# Altium schematic sheet Sheet3_24-7.SchDoc
size A3; SheetNumber: 1; SheetTotal: 1
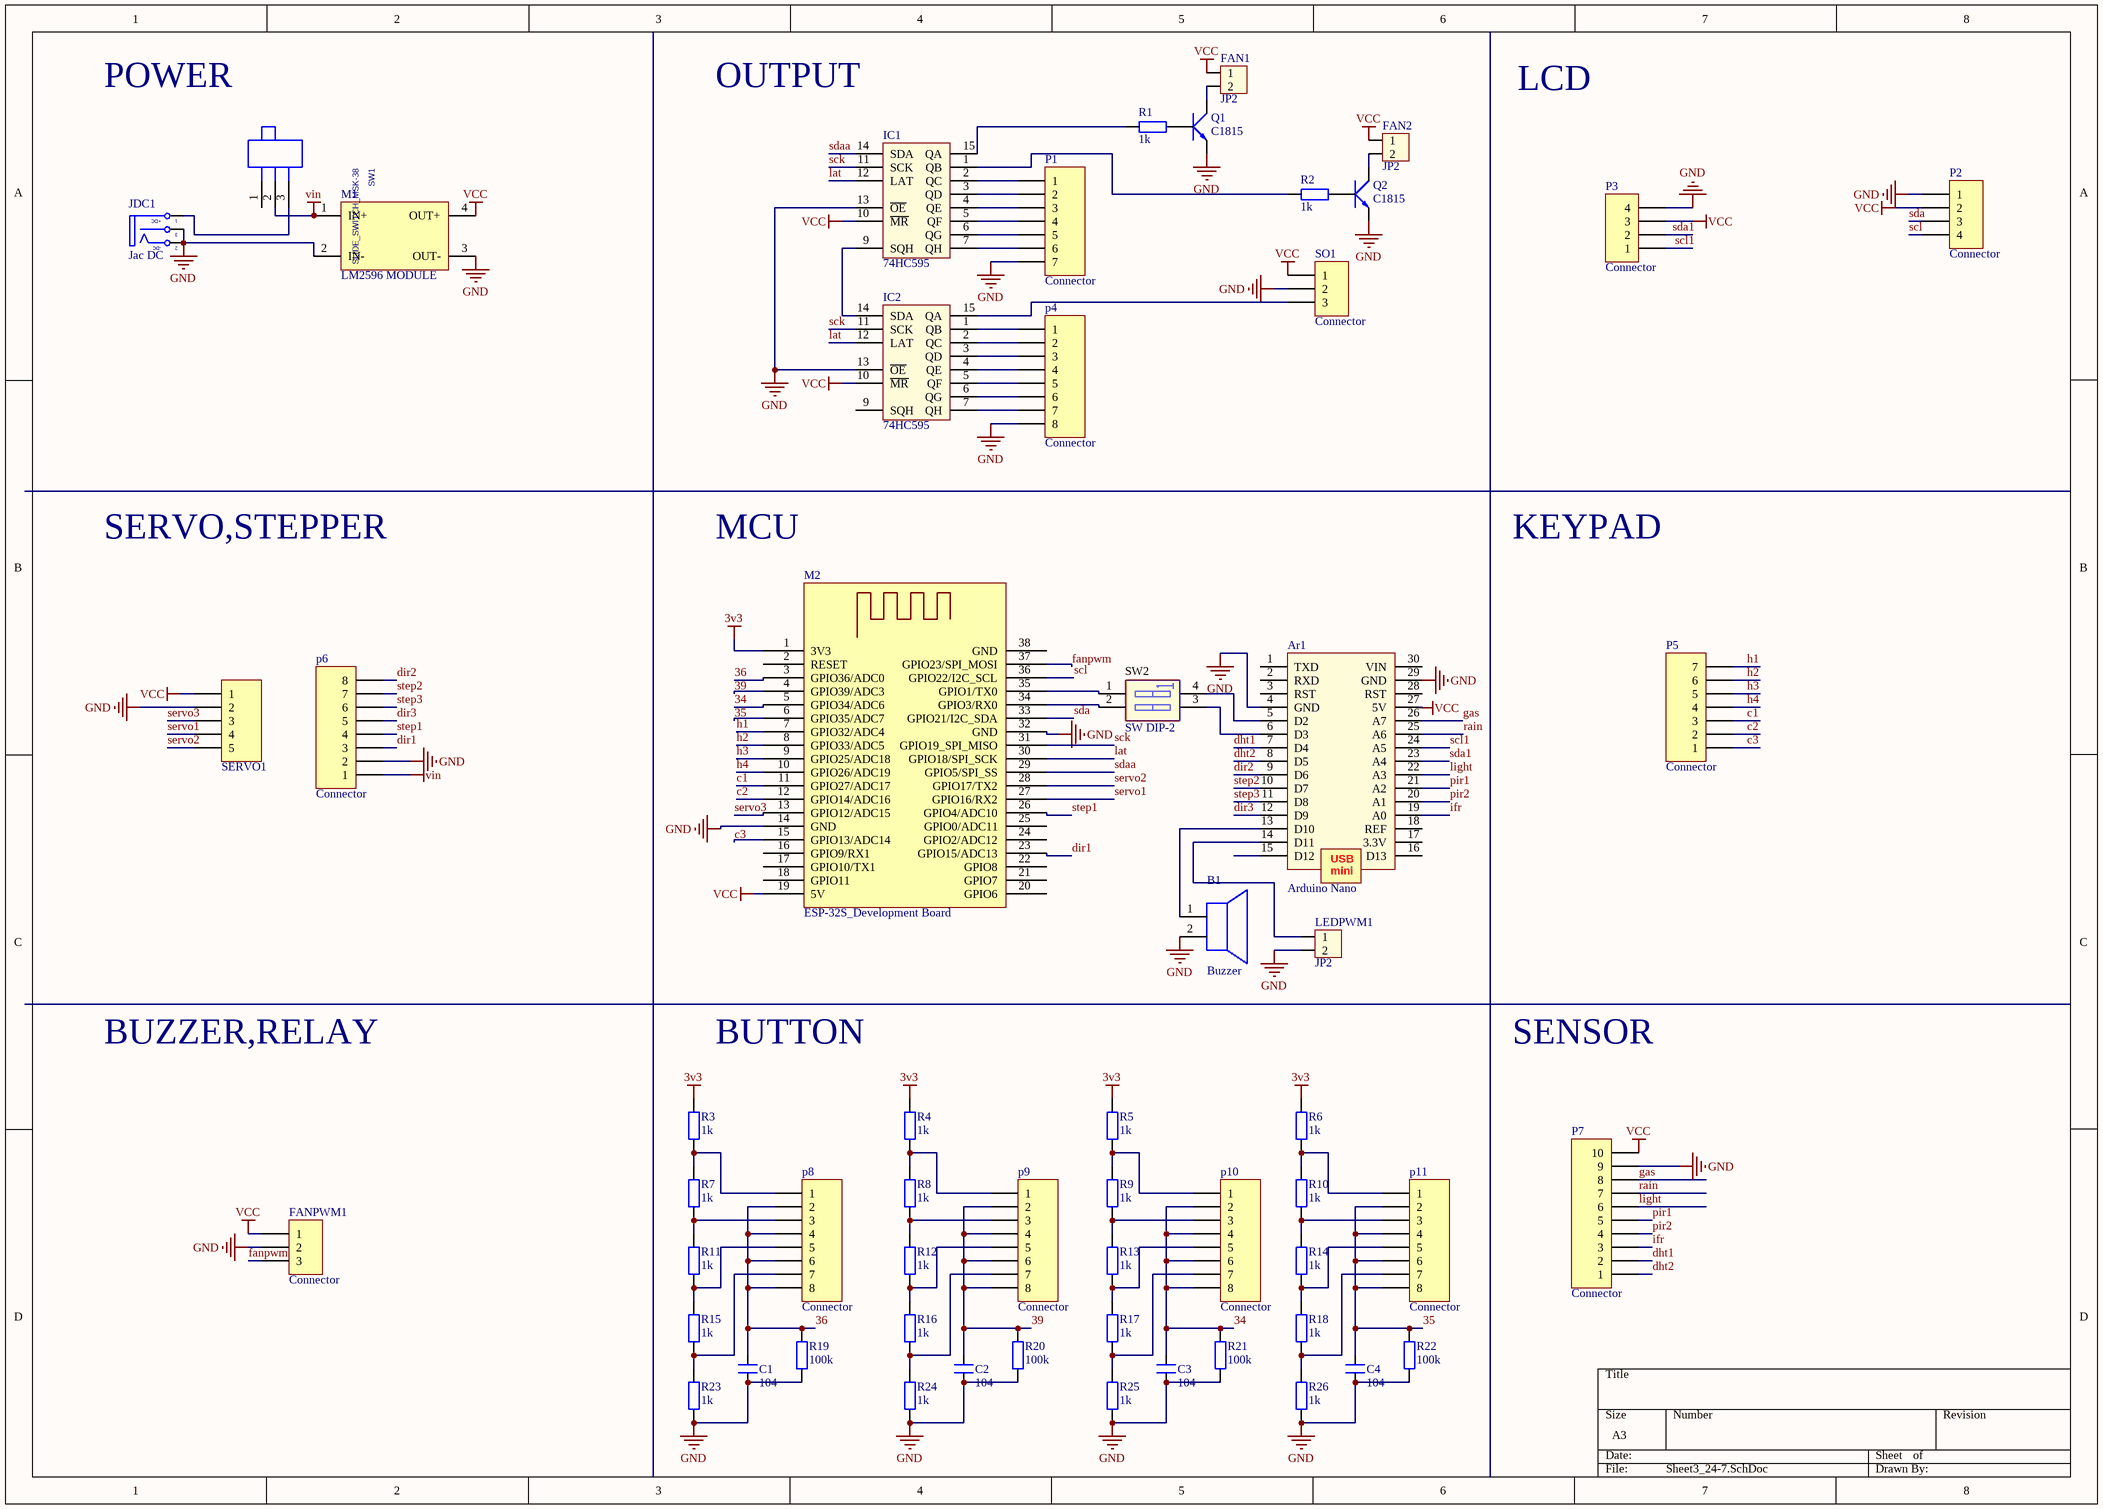
[diagram p0: Sheet3_24-7.SchDoc]

## Parts
Ar1  Arduino Nano  [Arduino_Nano]
B1  Buzzer  [Buzzer]
C1  104  [CN2]
C2  104  [CN2]
C3  104  [CN2]
C4  104  [CN2]
FAN1  JP2  [CON2]
FAN2  JP2  [CON2]
FANPWM1  Connector  [JST-XH_B3B-XH-A]
IC1  74HC595  [DIP16/W0.3]
IC2  74HC595  [DIP16/W0.3]
JDC1  Jac DC  [DC-IN]
LEDPWM1  JP2  [CON2]
M1  LM2596 MODULE  [LM2596_MODULE]
M2  ESP-32S_Development Board  [ESP32 NodeMCU]
P1  Connector  [JST-XH_B7B-XH-A]
P2  Connector  [JST-XH_B4B-XH-A]
P3  Connector  [JST-XH_B4B-XH-A]
p4  Connector  [JST-XH_B8B-XH-A]
P5  Connector  [JST-XH_B7B-XH-A]
p6  Connector  [JST-XH_B8B-XH-A]
P7  Connector  [JST-XH_B10B-XH-A]
p8  Connector  [JST-XH_B8B-XH-A]
p9  Connector  [JST-XH_B8B-XH-A]
p10  Connector  [JST-XH_B8B-XH-A]
p11  Connector  [JST-XH_B8B-XH-A]
Q1  C1815  [QTO-92]
Q2  C1815  [QTO-92]
R1  1k  [tro smd 0805]
R2  1k  [tro smd 0805]
R3  1k  [tro smd 0805]
R4  1k  [tro smd 0805]
R5  1k  [tro smd 0805]
R6  1k  [tro smd 0805]
R7  1k  [tro smd 0805]
R8  1k  [tro smd 0805]
R9  1k  [tro smd 0805]
R10  1k  [tro smd 0805]
R11  1k  [tro smd 0805]
R12  1k  [tro smd 0805]
R13  1k  [tro smd 0805]
R14  1k  [tro smd 0805]
R15  1k  [tro smd 0805]
R16  1k  [tro smd 0805]
R17  1k  [tro smd 0805]
R18  1k  [tro smd 0805]
R19  100k  [tro smd 0805]
R20  100k  [tro smd 0805]
R21  100k  [tro smd 0805]
R22  100k  [tro smd 0805]
R23  1k  [tro smd 0805]
R24  1k  [tro smd 0805]
R25  1k  [tro smd 0805]
R26  1k  [tro smd 0805]
SERVO1  Connector  [JST-XH_B5B-XH-A]  (value not drawn)
SO1  Connector  [JST-XH_B3B-XH-A]
SW1  SLIDE_SWITCH_MSK-38  [SW6_MSK-38]
SW2  SW DIP-2  [DIPSW2]

## Nets
3v3: M2.1(3V3) R3.1 R4.1 R5.1 R6.1
GND: Ar1.4(GND) Ar1.29(GND) B1.2(-) C1.1 C2.1 C3.1 C4.1 FANPWM1.2 IC1.8(GND) IC1.13(~{OE}) IC2.8(GND) IC2.13(~{OE}) JDC1.2(TN) JDC1.3(S) LEDPWM1.2 M1.2(IN-) M1.3(OUT-) M2.14(GND) M2.32(GND) P1.7 P2.1 P3.4 p4.8 p6.2 P7.9 Q1.1(E) Q2.1(E) R19.2 R20.2 R21.2 R22.2 R23.2 R24.2 R25.2 R26.2 SERVO1.2 SO1.2
VCC: Ar1.27(5V) FAN1.1 FAN2.1 FANPWM1.1 IC1.10(~{MR}) IC1.16(VCC) IC2.10(~{MR}) IC2.16(VCC) M1.4(OUT+) M2.19(5V) P2.2 P3.3 P7.10 SERVO1.1 SO1.1
vin: M1.1(IN+) p6.1 SW1.2
34: C3.2 M2.5(GPIO34/ADC6) p10.2 p10.4 p10.6 p10.8 R21.1
35: C4.2 M2.6(GPIO35/ADC7) p11.2 p11.4 p11.6 p11.8 R22.1
36: C1.2 M2.3(GPIO36/ADC0) p8.2 p8.4 p8.6 p8.8 R19.1
39: C2.2 M2.4(GPIO39/ADC3) p9.2 p9.4 p9.6 p9.8 R20.1
c1: M2.11(GPIO27/ADC17) P5.3
c2: M2.12(GPIO14/ADC16) P5.2
c3: M2.15(GPIO13/ADC14) P5.1
dht1: Ar1.7(D4) P7.2
dht2: Ar1.8(D5) P7.1
dir1: M2.23(GPIO15/ADC13) p6.3
dir2: Ar1.9(D6) p6.8
dir3: Ar1.12(D9) p6.5
fanpwm: FANPWM1.3 M2.37(GPIO23/SPI_MOSI)
gas: Ar1.26(A7) P7.8
h1: M2.7(GPIO32/ADC4) P5.7
h2: M2.8(GPIO33/ADC5) P5.6
h3: M2.9(GPIO25/ADC18) P5.5
h4: M2.10(GPIO26/ADC19) P5.4
ifr: Ar1.19(A0) P7.3
lat: IC1.12(LAT) IC2.12(LAT) M2.30(GPIO18/SPI_SCK)
light: Ar1.22(A3) P7.6
pir1: Ar1.21(A2) P7.5
pir2: Ar1.20(A1) P7.4
rain: Ar1.25(A6) P7.7
sck: IC1.11(SCK) IC2.11(SCK) M2.31(GPIO19_SPI_MISO)
scl: M2.36(GPIO22/I2C_SCL) P2.4
scl1: Ar1.24(A5) P3.1
sda: M2.33(GPIO21/I2C_SDA) P2.3
sda1: Ar1.23(A4) P3.2
sdaa: IC1.14(SDA) M2.29(GPIO5/SPI_SS)
servo1: M2.27(GPIO16/RX2) SERVO1.4
servo2: M2.28(GPIO17/TX2) SERVO1.5
servo3: M2.13(GPIO12/ADC15) SERVO1.3
step1: M2.26(GPIO4/ADC10) p6.4
step2: Ar1.10(D7) p6.7
step3: Ar1.11(D8) p6.6
NetAr1_5: Ar1.5(D2) SW2.4(B1)
NetAr1_6: Ar1.6(D3) SW2.3(B2)
NetAr1_13: Ar1.13(D10) B1.1(+)
NetAr1_14: Ar1.14(D11) LEDPWM1.1
NetFAN1_2: FAN1.2 Q1.2(C)
NetFAN2_2: FAN2.2 Q2.2(C)
NetIC1_1: IC1.1(QB) R2.2
NetIC1_2: IC1.2(QC) P1.1
NetIC1_3: IC1.3(QD) P1.2
NetIC1_4: IC1.4(QE) P1.3
NetIC1_5: IC1.5(QF) P1.4
NetIC1_6: IC1.6(QG) P1.5
NetIC1_7: IC1.7(QH) P1.6
NetIC1_9: IC1.9(SQH) IC2.14(SDA)
NetIC1_15: IC1.15(QA) R1.2
NetIC2_1: IC2.1(QB) p4.1
NetIC2_2: IC2.2(QC) p4.2
NetIC2_3: IC2.3(QD) p4.3
NetIC2_4: IC2.4(QE) p4.4
NetIC2_5: IC2.5(QF) p4.5
NetIC2_6: IC2.6(QG) p4.6
NetIC2_7: IC2.7(QH) p4.7
NetIC2_15: IC2.15(QA) SO1.3
NetJDC1_1: JDC1.1(T) SW1.3
NetM2_34: M2.34(GPIO3/RX0) SW2.2(A2)
NetM2_35: M2.35(GPIO1/TX0) SW2.1(A1)
Netp8_1: p8.1 R3.2 R7.1
Netp8_3: p8.3 R7.2 R11.1
Netp8_5: p8.5 R11.2 R15.1
Netp8_7: p8.7 R15.2 R23.1
Netp9_1: p9.1 R4.2 R8.1
Netp9_3: p9.3 R8.2 R12.1
Netp9_5: p9.5 R12.2 R16.1
Netp9_7: p9.7 R16.2 R24.1
Netp10_1: p10.1 R5.2 R9.1
Netp10_3: p10.3 R9.2 R13.1
Netp10_5: p10.5 R13.2 R17.1
Netp10_7: p10.7 R17.2 R25.1
Netp11_1: p11.1 R6.2 R10.1
Netp11_3: p11.3 R10.2 R14.1
Netp11_5: p11.5 R14.2 R18.1
Netp11_7: p11.7 R18.2 R26.1
NetQ1_3: Q1.3(B) R1.1
NetQ2_3: Q2.3(B) R2.1

Not connected (* = marked no-connect by the designer): Ar1 1(TXD) 2(RXD) 3(RST) 15(D12) 16(D13) 17(3.3V) 18(REF) 28(RST) 30(VIN); IC2 9(SQH); M2 2(RESET) 16(GPIO9/RX1) 17(GPIO10/TX1) 18(GPIO11) 20(GPIO6) 21(GPIO7) 22(GPIO8) 24(GPIO2/ADC12) 25(GPIO0/ADC11) 38(GND); SW1 1

## Notes on the sheet
- POWER
- OUTPUT
- LCD
- SERVO,STEPPER
- MCU
- KEYPAD
- BUZZER,RELAY
- BUTTON
- SENSOR
- (in symbol Arduino_Nano) USB; mini
- (in symbol DCIN) +DC; -DC

## Library data of the parts
Ar1 = Arduino_Nano
C1-C4 = CN2: Cap np 104 => 105pF; Value: 0.1uF
FAN1 FAN2 LEDPWM1 = Con2: Connector 2; Value: Connector 2
FANPWM1 SO1 = Connector_3pin
IC1 IC2 = 74595: 8 Bit Serial input - Parallel Output; Value: 74HC595
JDC1 = DCIN: Jac DC input; Value: Jac DC
M1 = LM2596_MODULE
M2 = WIFI_ESP-32S_Development Board: ESP32 NodeMCU LuaNode32 38 Pins
P1 P5 = Connector_7pin
P2 P3 = Connector_4pin
p4 p6 p8-p11 = Connector_8pin
P7 = Connector_10pin
Q1 Q2 = C1815_1: NPN 600mW, ECB; Value: C1815
R1-R26 = Tro 0805 1% 1k: Dán; Don_Vi: Con; So_Chan: 2; Ten_Linh_Kien: Trở 0805 1% 1k; Ma_Hang: MH005468; Chung_Loai: Dán; Kieu_Chan: *
SERVO1 = Connector_5pin
SW1 = SLIDE_SWITCH_MSK-38: SWITCH SLIDE SPDT 0.5A; Manufacturer: E-Switch; Manufacturer Part Number: 500SSP1S1M6QEA; Part Number: 021-SW-08; Allegro PCB Footprint: SLIDE_SW_2; Rating: 120V; Price: 3.1; Distributor: Digi-Key; Distributor Part Number: EG2478-ND; Layout PCB Footprint: SLIDE_SW_2; Part Type: Switches
SW2 = SW DIP-2: DIP Switch, 2 Position, SPST; Vendor: Digikey; Published: 24-Mar-1999; LatestRevisionDate: 17-Jul-2002; LatestRevisionNote: Re-released for DXP Platform.; PackageReference: DIP-4; Publisher: Altium Limited; ComponentLink1Description: Digikey Part Link; ComponentLink2Description: Open Datasheet; ComponentLink2URL: H:\LIBRARY\LIBRARY.Datasheet\